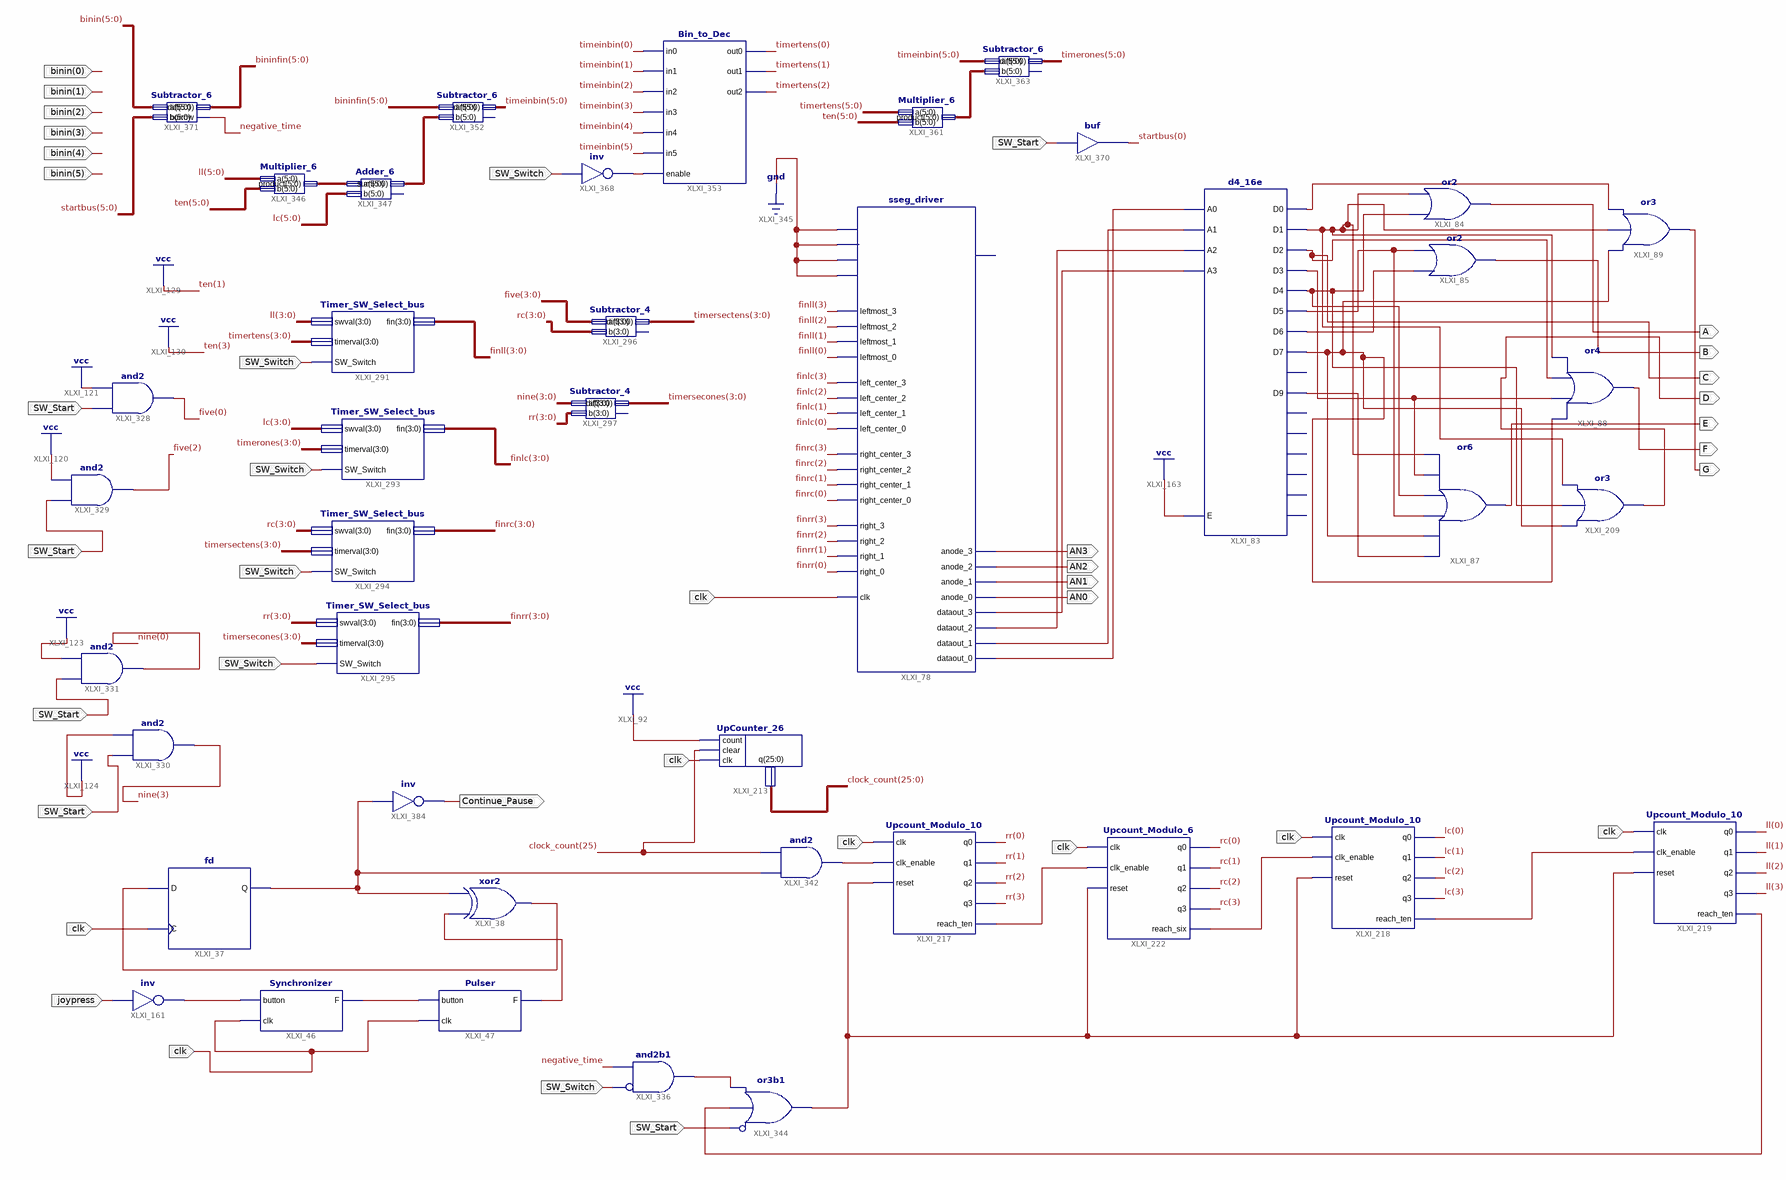
[diagram p0: schematic sheet 1]
// Xilinx ISE schematic Final_Project.sch (spartan3e) as structural Verilog: 41 symbols, 23 ports
module Final_Project (
  input  clk,
  input  SW_Switch,
  input  [5:0] binin,
  input  SW_Start,
  input  joypress,
  output A,
  output B,
  output D,
  output E,
  output F,
  output XLXN_294,
  output C,
  output G,
  output AN3,
  output AN2,
  output AN1,
  output AN0,
  output Continue_Pause
);

  wire negative_time, XLXN_122, XLXN_124, XLXN_126, XLXN_274, XLXN_282, XLXN_287, XLXN_288, XLXN_393,
       XLXN_396, XLXN_397, XLXN_398, XLXN_443, XLXN_444, XLXN_461, XLXN_528, XLXN_537, XLXN_549, XLXN_785,
       XLXN_938, XLXN_946, XLXN_948, XLXN_970, XLXN_1044, XLXN_1104;
  wire [3:0] finlc, finll, finrc, finrr, five, nine, rc, rr, timersecones, timersectens;
  wire [5:0] bininfin, lc, ll, startbus, ten, timeinbin, timerones, timertens, XLXN_973, XLXN_986, XLXN_1018;
  wire [25:0] clock_count;

  sseg_driver XLXI_78 (
    .clk(clk), .leftmost_3(finll[3]), .leftmost_2(finll[2]), .leftmost_1(finll[1]), .leftmost_0(finll[0]),
    .left_center_3(finlc[3]), .left_center_2(finlc[2]), .left_center_1(finlc[1]), .left_center_0(finlc[0]),
    .right_center_3(finrc[3]), .right_center_2(finrc[2]), .right_center_1(finrc[1]),
    .right_center_0(finrc[0]), .right_3(finrr[3]), .right_2(finrr[2]), .right_1(finrr[1]),
    .right_0(finrr[0]), .leftmost_dp(1'b0), .left_center_dp(1'b0), .right_center_dp(1'b0),
    .rightmost_dp(1'b0), .anode_3(AN3), .anode_2(AN2), .anode_1(AN1), .anode_0(AN0), .dataout_3(XLXN_393),
    .dataout_2(XLXN_396), .dataout_1(XLXN_397), .dataout_0(XLXN_398));  // open: dp
  d4_16e XLXI_83 (
    .A0(XLXN_398), .A1(XLXN_397), .A2(XLXN_396), .A3(XLXN_393), .E(1'b1), .D0(XLXN_294), .D1(XLXN_287),
    .D2(C), .D3(XLXN_946), .D4(XLXN_282), .D5(XLXN_948), .D6(XLXN_274), .D7(XLXN_288), .D9(XLXN_537));  // open: D10, D11, D12, D13, D14, D15, D8
  or XLXI_84 (A, XLXN_282, XLXN_287);
  or XLXI_85 (B, XLXN_274, XLXN_948);
  or XLXI_87 (E, XLXN_537, XLXN_288, XLXN_948, XLXN_282, XLXN_946, XLXN_287);
  or XLXI_88 (F, XLXN_288, XLXN_946, C, XLXN_287);
  or XLXI_89 (G, XLXN_288, XLXN_287, XLXN_294);
  or XLXI_209 (D, XLXN_288, XLXN_282, XLXN_287);
  Timer_SW_Select_bus XLXI_291 (.fin(finll), .swval(ll[3:0]), .SW_Switch(SW_Switch), .timerval(timertens[3:0]));
  Timer_SW_Select_bus XLXI_293 (.fin(finlc), .swval(lc[3:0]), .SW_Switch(SW_Switch), .timerval(timerones[3:0]));
  Timer_SW_Select_bus XLXI_294 (.fin(finrc), .swval(rc), .SW_Switch(SW_Switch), .timerval(timersectens));
  Timer_SW_Select_bus XLXI_295 (.fin(finrr), .swval(rr), .SW_Switch(SW_Switch), .timerval(timersecones));
  Subtractor_4 XLXI_296 (.a(five), .b(rc), .diff(timersectens));  // open: borrow
  Subtractor_4 XLXI_297 (.a(nine), .b(rr), .diff(timersecones));  // open: borrow
  UpCounter_26 XLXI_213 (.clk(clk), .q(clock_count), .clear(clock_count[25]), .count(1'b1));
  Upcount_Modulo_10 XLXI_217 (
    .clk(clk), .clk_enable(XLXN_938), .q0(rr[0]), .q1(rr[1]), .q2(rr[2]), .q3(rr[3]), .reach_ten(XLXN_443),
    .reset(XLXN_549));
  Upcount_Modulo_10 XLXI_218 (
    .clk(clk), .clk_enable(XLXN_444), .q0(lc[0]), .q1(lc[1]), .q2(lc[2]), .q3(lc[3]), .reach_ten(XLXN_528),
    .reset(XLXN_549));
  Upcount_Modulo_10 XLXI_219 (
    .clk(clk), .clk_enable(XLXN_528), .q0(ll[0]), .q1(ll[1]), .q2(ll[2]), .q3(ll[3]), .reach_ten(XLXN_785),
    .reset(XLXN_549));
  Upcount_Modulo_6 XLXI_222 (
    .clk(clk), .clk_enable(XLXN_443), .q0(rc[0]), .q1(rc[1]), .q2(rc[2]), .q3(rc[3]), .reach_six(XLXN_444),
    .reset(XLXN_549));
  Pulser XLXI_47 (.button(XLXN_122), .clk(clk), .F(XLXN_124));
  xor XLXI_38 (XLXN_126, XLXN_124, XLXN_1104);
  Synchronizer XLXI_46 (.button(XLXN_461), .clk(clk), .F(XLXN_122));
  fd XLXI_37 (.C(clk), .D(XLXN_126), .Q(XLXN_1104));
  not XLXI_161 (XLXN_461, joypress);
  and XLXI_328 (five[0], SW_Start, 1'b1);
  and XLXI_329 (five[2], SW_Start, 1'b1);
  and XLXI_330 (nine[3], SW_Start, 1'b1);
  and XLXI_331 (nine[0], SW_Start, 1'b1);
  and XLXI_342 (XLXN_938, XLXN_1104, clock_count[25]);
  or XLXI_344 (XLXN_549, ~SW_Start, XLXN_785, XLXN_970);  // or3b1
  Bin_to_Dec XLXI_353 (
    .enable(XLXN_1044), .in0(timeinbin[0]), .in1(timeinbin[1]), .in2(timeinbin[2]), .in3(timeinbin[3]),
    .in4(timeinbin[4]), .in5(timeinbin[5]), .out0(timertens[0]), .out1(timertens[1]), .out2(timertens[2]));
  Multiplier_6 XLXI_361 (.a(timertens), .b({ten[5:4], 1'b1, ten[2], 1'b1, ten[0]}), .product(XLXN_1018));
  Subtractor_6 XLXI_363 (.a(timeinbin), .b(XLXN_1018), .diff(timerones));  // open: borrow
  Multiplier_6 XLXI_346 (.a(ll), .b({ten[5:4], 1'b1, ten[2], 1'b1, ten[0]}), .product(XLXN_973));
  Subtractor_6 XLXI_352 (.a(bininfin), .b(XLXN_986), .diff(timeinbin));  // open: borrow
  Adder_6 XLXI_347 (.a(XLXN_973), .b(lc), .sum(XLXN_986));  // open: carry
  not XLXI_368 (XLXN_1044, SW_Switch);
  buf XLXI_370 (startbus[0], SW_Start);
  Subtractor_6 XLXI_371 (.a(binin), .b(startbus), .borrow(negative_time), .diff(bininfin));
  not XLXI_384 (Continue_Pause, XLXN_1104);
  and XLXI_336 (XLXN_970, ~SW_Switch, negative_time);  // and2b1

  // Notes on the sheet:
  //   clk on signal clk = P89
  //   LOC on signal A = P57
  //   LOC on signal B = P65
  //   LOC on signal D = P53
  //   LOC on signal E = P33
  //   LOC on signal F = P35
  //   LOC on signal C = P40
  //   LOC on signal G = P62
  //   LOC on signal AN3 = P67
  //   LOC on signal AN2 = P60
  //   LOC on signal AN1 = P26
  //   LOC on signal AN0 = P18
  //   LOC on signal SW_Switch = P91
  //   LOC on signal binin(0) = P4
  //   LOC on signal binin(1) = P3
  //   LOC on signal binin(2) = P2
  //   LOC on signal binin(3) = P98
  //   LOC on signal binin(4) = P95
  //   LOC on signal binin(5) = P94
  //   LOC on signal SW_Start = P92
  //   LOC on signal joypress = P22
  //   LOC on signal Continue_Pause = P5
endmodule
